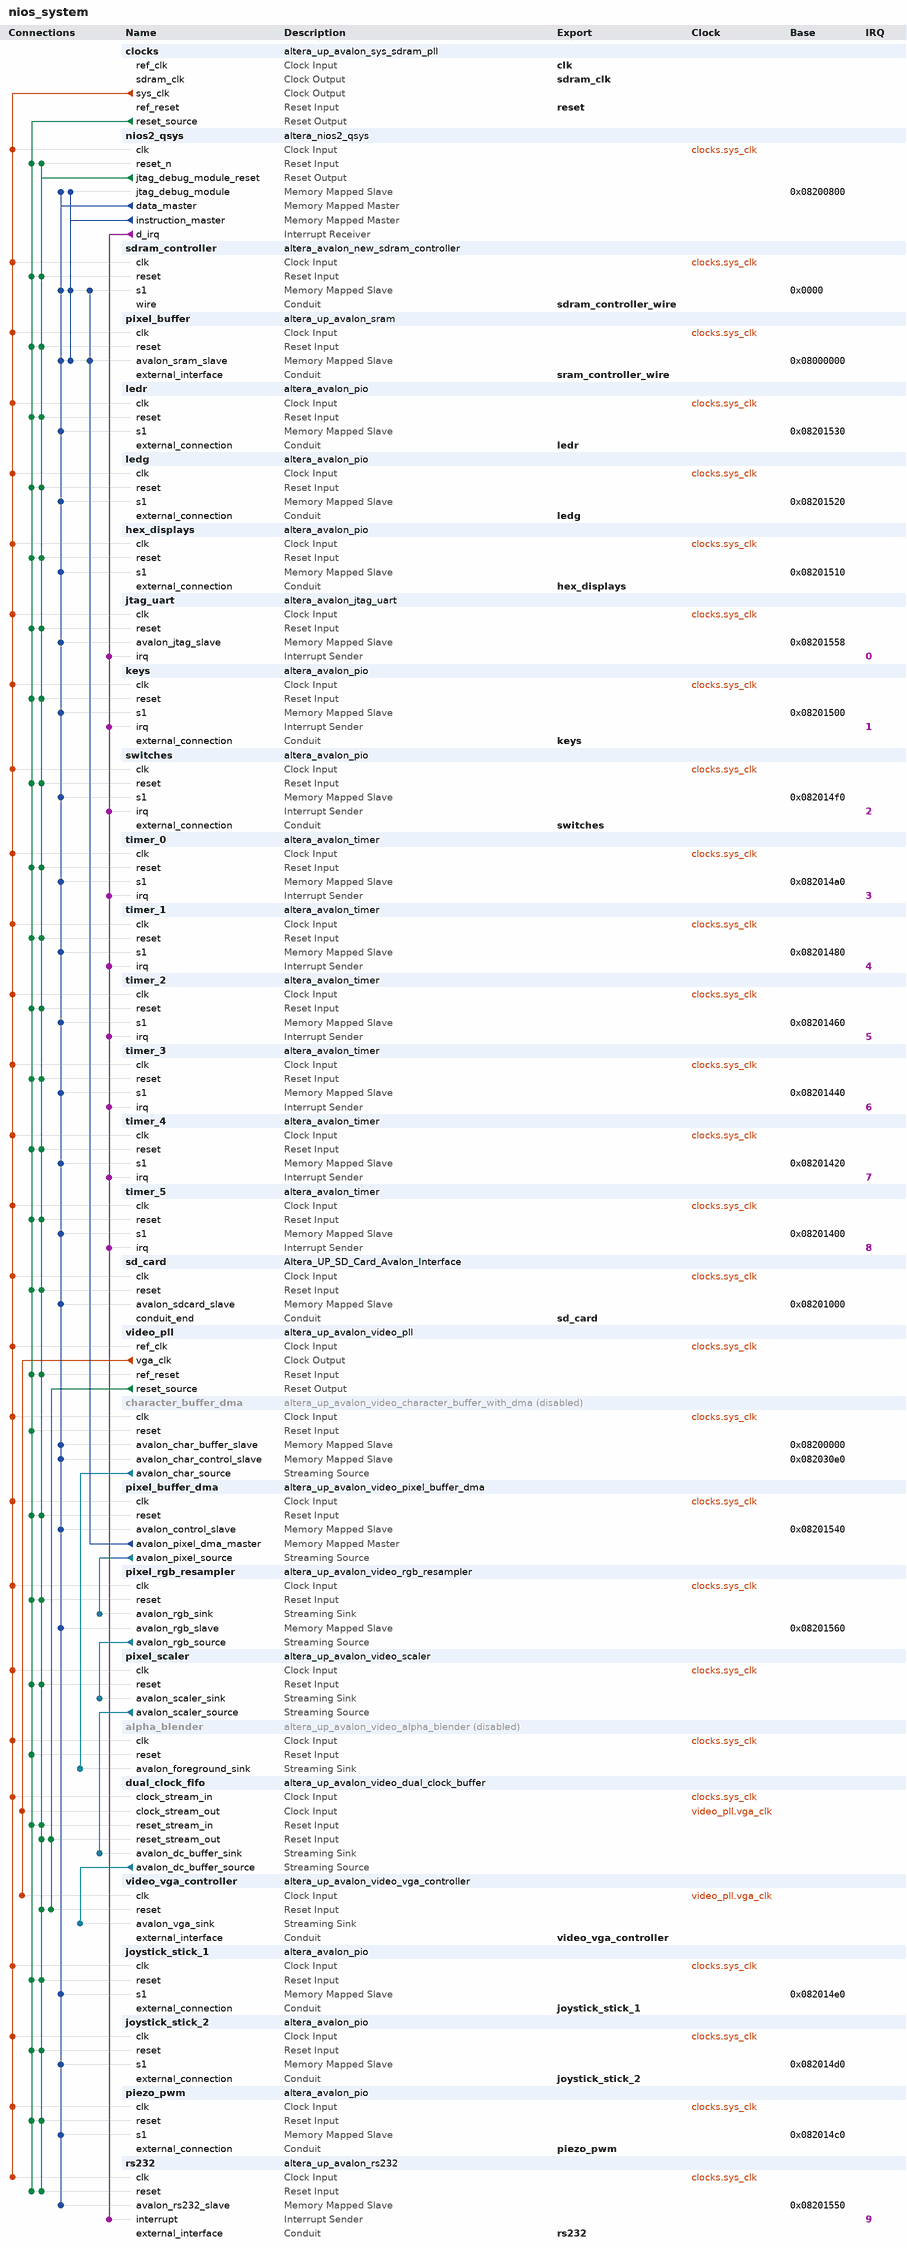
[diagram p0: system contents]
# Platform Designer (Qsys) system nios_system, Cyclone IV E EP4CE115F29C7
# Parameters at their usual value, and those the tool derives, are not listed.
package require -exact qsys 17.1
create_system nios_system
set_project_property DEVICE_FAMILY {Cyclone IV E}
set_project_property DEVICE EP4CE115F29C7

add_instance clocks altera_up_avalon_sys_sdram_pll 17.1
set_instance_parameter_value clocks CV_boards DE10-Standard
set_instance_parameter_value clocks gui_outclk 50.0
set_instance_parameter_value clocks gui_refclk 50.0

add_instance nios2_qsys altera_nios2_qsys 16.1
set_instance_parameter_value nios2_qsys breakSlave nios2_qsys.jtag_debug_module
set_instance_parameter_value nios2_qsys exceptionSlave sdram_controller.s1
set_instance_parameter_value nios2_qsys icache_size 4096
set_instance_parameter_value nios2_qsys impl Fast
set_instance_parameter_value nios2_qsys mmu_TLBMissExcSlave None
set_instance_parameter_value nios2_qsys muldiv_divider true
set_instance_parameter_value nios2_qsys resetSlave sdram_controller.s1
set_instance_parameter_value nios2_qsys resetrequest_enabled true

add_instance sdram_controller altera_avalon_new_sdram_controller 17.1
set_instance_parameter_value sdram_controller TAC 5.4
set_instance_parameter_value sdram_controller TRCD 15.0
set_instance_parameter_value sdram_controller TRP 15.0
set_instance_parameter_value sdram_controller casLatency 3
set_instance_parameter_value sdram_controller columnWidth 10
set_instance_parameter_value sdram_controller dataWidth 32
set_instance_parameter_value sdram_controller generateSimulationModel false
set_instance_parameter_value sdram_controller model single_Micron_MT48LC4M32B2_7_chip
set_instance_parameter_value sdram_controller numberOfBanks 4
set_instance_parameter_value sdram_controller numberOfChipSelects 1
set_instance_parameter_value sdram_controller powerUpDelay 100.0
set_instance_parameter_value sdram_controller refreshPeriod 7.8125
set_instance_parameter_value sdram_controller rowWidth 13

add_instance pixel_buffer altera_up_avalon_sram 17.1
set_instance_parameter_value pixel_buffer board DE2-115
set_instance_parameter_value pixel_buffer pixel_buffer true

add_instance ledr altera_avalon_pio 17.1
set_instance_parameter_value ledr direction Output
set_instance_parameter_value ledr width 18

add_instance ledg altera_avalon_pio 17.1
set_instance_parameter_value ledg direction Output
set_instance_parameter_value ledg width 9

add_instance hex_displays altera_avalon_pio 17.1
set_instance_parameter_value hex_displays direction Output
set_instance_parameter_value hex_displays width 32

add_instance jtag_uart altera_avalon_jtag_uart 17.1
set_instance_parameter_value jtag_uart simInteractiveOptions NO_INTERACTIVE_WINDOWS

add_instance keys altera_avalon_pio 17.1
set_instance_parameter_value keys captureEdge true
set_instance_parameter_value keys direction Input
set_instance_parameter_value keys edgeType FALLING
set_instance_parameter_value keys generateIRQ true
set_instance_parameter_value keys irqType EDGE
set_instance_parameter_value keys width 4

add_instance switches altera_avalon_pio 17.1
set_instance_parameter_value switches captureEdge true
set_instance_parameter_value switches direction Input
set_instance_parameter_value switches edgeType FALLING
set_instance_parameter_value switches generateIRQ true
set_instance_parameter_value switches irqType EDGE
set_instance_parameter_value switches width 18

add_instance timer_0 altera_avalon_timer 17.1
set_instance_parameter_value timer_0 period 1
set_instance_parameter_value timer_0 periodUnits MSEC

add_instance timer_1 altera_avalon_timer 17.1
set_instance_parameter_value timer_1 period 1
set_instance_parameter_value timer_1 periodUnits MSEC

add_instance timer_2 altera_avalon_timer 17.1
set_instance_parameter_value timer_2 period 1
set_instance_parameter_value timer_2 periodUnits MSEC

add_instance timer_3 altera_avalon_timer 17.1
set_instance_parameter_value timer_3 period 1
set_instance_parameter_value timer_3 periodUnits MSEC

add_instance timer_4 altera_avalon_timer 17.1
set_instance_parameter_value timer_4 period 1
set_instance_parameter_value timer_4 periodUnits MSEC

add_instance timer_5 altera_avalon_timer 17.1
set_instance_parameter_value timer_5 period 1
set_instance_parameter_value timer_5 periodUnits MSEC

add_instance sd_card Altera_UP_SD_Card_Avalon_Interface 17.1

add_instance video_pll altera_up_avalon_video_pll 17.1
set_instance_parameter_value video_pll camera {5MP Digital Camera (THDB_D5M)}
set_instance_parameter_value video_pll gui_refclk 50.0
set_instance_parameter_value video_pll lcd {7" LCD on VEEK-MT and MTL/MTL2 Modules}

add_instance character_buffer_dma altera_up_avalon_video_character_buffer_with_dma 17.1
set_instance_property character_buffer_dma ENABLED false
set_instance_parameter_value character_buffer_dma enable_transparency true

add_instance pixel_buffer_dma altera_up_avalon_video_pixel_buffer_dma 17.1
set_instance_parameter_value pixel_buffer_dma addr_mode X-Y
set_instance_parameter_value pixel_buffer_dma back_start_address 135266304
set_instance_parameter_value pixel_buffer_dma color_space {16-bit RGB}
set_instance_parameter_value pixel_buffer_dma image_height 240
set_instance_parameter_value pixel_buffer_dma image_width 320
set_instance_parameter_value pixel_buffer_dma start_address 134217728

add_instance pixel_rgb_resampler altera_up_avalon_video_rgb_resampler 17.1
set_instance_parameter_value pixel_rgb_resampler alpha 1023
set_instance_parameter_value pixel_rgb_resampler input_type {16-bit RGB}
set_instance_parameter_value pixel_rgb_resampler output_type {30-bit RGB}

add_instance pixel_scaler altera_up_avalon_video_scaler 17.1
set_instance_parameter_value pixel_scaler color_bits 10
set_instance_parameter_value pixel_scaler color_planes 3
set_instance_parameter_value pixel_scaler height_scaling 2
set_instance_parameter_value pixel_scaler width_in 320
set_instance_parameter_value pixel_scaler width_scaling 2

add_instance alpha_blender altera_up_avalon_video_alpha_blender 17.1
set_instance_property alpha_blender ENABLED false

add_instance dual_clock_fifo altera_up_avalon_video_dual_clock_buffer 17.1
set_instance_parameter_value dual_clock_fifo color_bits 10

add_instance video_vga_controller altera_up_avalon_video_vga_controller 17.1
set_instance_parameter_value video_vga_controller board DE2-115
set_instance_parameter_value video_vga_controller resolution {VGA 640x480}

add_instance joystick_stick_1 altera_avalon_pio 17.1
set_instance_parameter_value joystick_stick_1 direction Input
set_instance_parameter_value joystick_stick_1 width 5

add_instance joystick_stick_2 altera_avalon_pio 17.1
set_instance_parameter_value joystick_stick_2 direction Input
set_instance_parameter_value joystick_stick_2 width 5

add_instance piezo_pwm altera_avalon_pio 17.1
set_instance_parameter_value piezo_pwm direction Output
set_instance_parameter_value piezo_pwm width 1

add_instance rs232 altera_up_avalon_rs232 17.1
set_instance_parameter_value rs232 baud 9600
set_instance_parameter_value rs232 parity None

# connections
add_connection clocks.sys_clk alpha_blender.clk clock
add_connection clocks.sys_clk character_buffer_dma.clk clock
add_connection clocks.sys_clk dual_clock_fifo.clock_stream_in clock
add_connection clocks.sys_clk hex_displays.clk clock
add_connection clocks.sys_clk joystick_stick_1.clk clock
add_connection clocks.sys_clk joystick_stick_2.clk clock
add_connection clocks.sys_clk jtag_uart.clk clock
add_connection clocks.sys_clk keys.clk clock
add_connection clocks.sys_clk ledg.clk clock
add_connection clocks.sys_clk ledr.clk clock
add_connection clocks.sys_clk nios2_qsys.clk clock
add_connection clocks.sys_clk piezo_pwm.clk clock
add_connection clocks.sys_clk pixel_buffer.clk clock
add_connection clocks.sys_clk pixel_buffer_dma.clk clock
add_connection clocks.sys_clk pixel_rgb_resampler.clk clock
add_connection clocks.sys_clk pixel_scaler.clk clock
add_connection clocks.sys_clk rs232.clk clock
add_connection clocks.sys_clk sd_card.clk clock
add_connection clocks.sys_clk sdram_controller.clk clock
add_connection clocks.sys_clk switches.clk clock
add_connection clocks.sys_clk timer_0.clk clock
add_connection clocks.sys_clk timer_1.clk clock
add_connection clocks.sys_clk timer_2.clk clock
add_connection clocks.sys_clk timer_3.clk clock
add_connection clocks.sys_clk timer_4.clk clock
add_connection clocks.sys_clk timer_5.clk clock
add_connection clocks.sys_clk video_pll.ref_clk clock
add_connection video_pll.vga_clk dual_clock_fifo.clock_stream_out clock
add_connection video_pll.vga_clk video_vga_controller.clk clock
add_connection clocks.reset_source alpha_blender.reset reset
add_connection clocks.reset_source character_buffer_dma.reset reset
add_connection clocks.reset_source dual_clock_fifo.reset_stream_in reset
add_connection clocks.reset_source hex_displays.reset reset
add_connection clocks.reset_source joystick_stick_1.reset reset
add_connection clocks.reset_source joystick_stick_2.reset reset
add_connection clocks.reset_source jtag_uart.reset reset
add_connection clocks.reset_source keys.reset reset
add_connection clocks.reset_source ledg.reset reset
add_connection clocks.reset_source ledr.reset reset
add_connection clocks.reset_source nios2_qsys.reset_n reset
add_connection clocks.reset_source piezo_pwm.reset reset
add_connection clocks.reset_source pixel_buffer.reset reset
add_connection clocks.reset_source pixel_buffer_dma.reset reset
add_connection clocks.reset_source pixel_rgb_resampler.reset reset
add_connection clocks.reset_source pixel_scaler.reset reset
add_connection clocks.reset_source rs232.reset reset
add_connection clocks.reset_source sd_card.reset reset
add_connection clocks.reset_source sdram_controller.reset reset
add_connection clocks.reset_source switches.reset reset
add_connection clocks.reset_source timer_0.reset reset
add_connection clocks.reset_source timer_1.reset reset
add_connection clocks.reset_source timer_2.reset reset
add_connection clocks.reset_source timer_3.reset reset
add_connection clocks.reset_source timer_4.reset reset
add_connection clocks.reset_source timer_5.reset reset
add_connection clocks.reset_source video_pll.ref_reset reset
add_connection nios2_qsys.jtag_debug_module_reset dual_clock_fifo.reset_stream_in reset
add_connection nios2_qsys.jtag_debug_module_reset dual_clock_fifo.reset_stream_out reset
add_connection nios2_qsys.jtag_debug_module_reset hex_displays.reset reset
add_connection nios2_qsys.jtag_debug_module_reset joystick_stick_1.reset reset
add_connection nios2_qsys.jtag_debug_module_reset joystick_stick_2.reset reset
add_connection nios2_qsys.jtag_debug_module_reset jtag_uart.reset reset
add_connection nios2_qsys.jtag_debug_module_reset keys.reset reset
add_connection nios2_qsys.jtag_debug_module_reset ledg.reset reset
add_connection nios2_qsys.jtag_debug_module_reset ledr.reset reset
add_connection nios2_qsys.jtag_debug_module_reset nios2_qsys.reset_n reset
add_connection nios2_qsys.jtag_debug_module_reset piezo_pwm.reset reset
add_connection nios2_qsys.jtag_debug_module_reset pixel_buffer.reset reset
add_connection nios2_qsys.jtag_debug_module_reset pixel_buffer_dma.reset reset
add_connection nios2_qsys.jtag_debug_module_reset pixel_rgb_resampler.reset reset
add_connection nios2_qsys.jtag_debug_module_reset pixel_scaler.reset reset
add_connection nios2_qsys.jtag_debug_module_reset rs232.reset reset
add_connection nios2_qsys.jtag_debug_module_reset sd_card.reset reset
add_connection nios2_qsys.jtag_debug_module_reset sdram_controller.reset reset
add_connection nios2_qsys.jtag_debug_module_reset switches.reset reset
add_connection nios2_qsys.jtag_debug_module_reset timer_0.reset reset
add_connection nios2_qsys.jtag_debug_module_reset timer_1.reset reset
add_connection nios2_qsys.jtag_debug_module_reset timer_2.reset reset
add_connection nios2_qsys.jtag_debug_module_reset timer_3.reset reset
add_connection nios2_qsys.jtag_debug_module_reset timer_4.reset reset
add_connection nios2_qsys.jtag_debug_module_reset timer_5.reset reset
add_connection nios2_qsys.jtag_debug_module_reset video_pll.ref_reset reset
add_connection nios2_qsys.jtag_debug_module_reset video_vga_controller.reset reset
add_connection video_pll.reset_source dual_clock_fifo.reset_stream_out reset
add_connection video_pll.reset_source video_vga_controller.reset reset
add_connection nios2_qsys.data_master character_buffer_dma.avalon_char_buffer_slave avalon
set_connection_parameter_value nios2_qsys.data_master/character_buffer_dma.avalon_char_buffer_slave baseAddress 0x08200000
add_connection nios2_qsys.data_master character_buffer_dma.avalon_char_control_slave avalon
set_connection_parameter_value nios2_qsys.data_master/character_buffer_dma.avalon_char_control_slave baseAddress 0x082030e0
add_connection nios2_qsys.data_master hex_displays.s1 avalon
set_connection_parameter_value nios2_qsys.data_master/hex_displays.s1 baseAddress 0x08201510
add_connection nios2_qsys.data_master joystick_stick_1.s1 avalon
set_connection_parameter_value nios2_qsys.data_master/joystick_stick_1.s1 baseAddress 0x082014e0
add_connection nios2_qsys.data_master joystick_stick_2.s1 avalon
set_connection_parameter_value nios2_qsys.data_master/joystick_stick_2.s1 baseAddress 0x082014d0
add_connection nios2_qsys.data_master jtag_uart.avalon_jtag_slave avalon
set_connection_parameter_value nios2_qsys.data_master/jtag_uart.avalon_jtag_slave baseAddress 0x08201558
add_connection nios2_qsys.data_master keys.s1 avalon
set_connection_parameter_value nios2_qsys.data_master/keys.s1 baseAddress 0x08201500
add_connection nios2_qsys.data_master ledg.s1 avalon
set_connection_parameter_value nios2_qsys.data_master/ledg.s1 baseAddress 0x08201520
add_connection nios2_qsys.data_master ledr.s1 avalon
set_connection_parameter_value nios2_qsys.data_master/ledr.s1 baseAddress 0x08201530
add_connection nios2_qsys.data_master nios2_qsys.jtag_debug_module avalon
set_connection_parameter_value nios2_qsys.data_master/nios2_qsys.jtag_debug_module baseAddress 0x08200800
add_connection nios2_qsys.data_master piezo_pwm.s1 avalon
set_connection_parameter_value nios2_qsys.data_master/piezo_pwm.s1 baseAddress 0x082014c0
add_connection nios2_qsys.data_master pixel_buffer.avalon_sram_slave avalon
set_connection_parameter_value nios2_qsys.data_master/pixel_buffer.avalon_sram_slave baseAddress 0x08000000
add_connection nios2_qsys.data_master pixel_buffer_dma.avalon_control_slave avalon
set_connection_parameter_value nios2_qsys.data_master/pixel_buffer_dma.avalon_control_slave baseAddress 0x08201540
add_connection nios2_qsys.data_master pixel_rgb_resampler.avalon_rgb_slave avalon
set_connection_parameter_value nios2_qsys.data_master/pixel_rgb_resampler.avalon_rgb_slave baseAddress 0x08201560
add_connection nios2_qsys.data_master rs232.avalon_rs232_slave avalon
set_connection_parameter_value nios2_qsys.data_master/rs232.avalon_rs232_slave baseAddress 0x08201550
add_connection nios2_qsys.data_master sd_card.avalon_sdcard_slave avalon
set_connection_parameter_value nios2_qsys.data_master/sd_card.avalon_sdcard_slave baseAddress 0x08201000
add_connection nios2_qsys.data_master sdram_controller.s1 avalon
set_connection_parameter_value nios2_qsys.data_master/sdram_controller.s1 baseAddress 0x0000
add_connection nios2_qsys.data_master switches.s1 avalon
set_connection_parameter_value nios2_qsys.data_master/switches.s1 baseAddress 0x082014f0
add_connection nios2_qsys.data_master timer_0.s1 avalon
set_connection_parameter_value nios2_qsys.data_master/timer_0.s1 baseAddress 0x082014a0
add_connection nios2_qsys.data_master timer_1.s1 avalon
set_connection_parameter_value nios2_qsys.data_master/timer_1.s1 baseAddress 0x08201480
add_connection nios2_qsys.data_master timer_2.s1 avalon
set_connection_parameter_value nios2_qsys.data_master/timer_2.s1 baseAddress 0x08201460
add_connection nios2_qsys.data_master timer_3.s1 avalon
set_connection_parameter_value nios2_qsys.data_master/timer_3.s1 baseAddress 0x08201440
add_connection nios2_qsys.data_master timer_4.s1 avalon
set_connection_parameter_value nios2_qsys.data_master/timer_4.s1 baseAddress 0x08201420
add_connection nios2_qsys.data_master timer_5.s1 avalon
set_connection_parameter_value nios2_qsys.data_master/timer_5.s1 baseAddress 0x08201400
add_connection nios2_qsys.instruction_master nios2_qsys.jtag_debug_module avalon
set_connection_parameter_value nios2_qsys.instruction_master/nios2_qsys.jtag_debug_module baseAddress 0x08200800
add_connection nios2_qsys.instruction_master pixel_buffer.avalon_sram_slave avalon
set_connection_parameter_value nios2_qsys.instruction_master/pixel_buffer.avalon_sram_slave baseAddress 0x08000000
add_connection nios2_qsys.instruction_master sdram_controller.s1 avalon
set_connection_parameter_value nios2_qsys.instruction_master/sdram_controller.s1 baseAddress 0x0000
add_connection pixel_buffer_dma.avalon_pixel_dma_master pixel_buffer.avalon_sram_slave avalon
set_connection_parameter_value pixel_buffer_dma.avalon_pixel_dma_master/pixel_buffer.avalon_sram_slave baseAddress 0x08000000
add_connection pixel_buffer_dma.avalon_pixel_dma_master sdram_controller.s1 avalon
set_connection_parameter_value pixel_buffer_dma.avalon_pixel_dma_master/sdram_controller.s1 baseAddress 0x0000
add_connection character_buffer_dma.avalon_char_source alpha_blender.avalon_foreground_sink avalon_streaming
add_connection dual_clock_fifo.avalon_dc_buffer_source video_vga_controller.avalon_vga_sink avalon_streaming
add_connection pixel_buffer_dma.avalon_pixel_source pixel_rgb_resampler.avalon_rgb_sink avalon_streaming
add_connection pixel_rgb_resampler.avalon_rgb_source pixel_scaler.avalon_scaler_sink avalon_streaming
add_connection pixel_scaler.avalon_scaler_source dual_clock_fifo.avalon_dc_buffer_sink avalon_streaming
add_connection nios2_qsys.d_irq jtag_uart.irq interrupt
set_connection_parameter_value nios2_qsys.d_irq/jtag_uart.irq irqNumber 0
add_connection nios2_qsys.d_irq keys.irq interrupt
set_connection_parameter_value nios2_qsys.d_irq/keys.irq irqNumber 1
add_connection nios2_qsys.d_irq rs232.interrupt interrupt
set_connection_parameter_value nios2_qsys.d_irq/rs232.interrupt irqNumber 9
add_connection nios2_qsys.d_irq switches.irq interrupt
set_connection_parameter_value nios2_qsys.d_irq/switches.irq irqNumber 2
add_connection nios2_qsys.d_irq timer_0.irq interrupt
set_connection_parameter_value nios2_qsys.d_irq/timer_0.irq irqNumber 3
add_connection nios2_qsys.d_irq timer_1.irq interrupt
set_connection_parameter_value nios2_qsys.d_irq/timer_1.irq irqNumber 4
add_connection nios2_qsys.d_irq timer_2.irq interrupt
set_connection_parameter_value nios2_qsys.d_irq/timer_2.irq irqNumber 5
add_connection nios2_qsys.d_irq timer_3.irq interrupt
set_connection_parameter_value nios2_qsys.d_irq/timer_3.irq irqNumber 6
add_connection nios2_qsys.d_irq timer_4.irq interrupt
set_connection_parameter_value nios2_qsys.d_irq/timer_4.irq irqNumber 7
add_connection nios2_qsys.d_irq timer_5.irq interrupt
set_connection_parameter_value nios2_qsys.d_irq/timer_5.irq irqNumber 8

# exported interfaces
add_interface clk clock sink
set_interface_property clk EXPORT_OF clocks.ref_clk
add_interface hex_displays conduit end
set_interface_property hex_displays EXPORT_OF hex_displays.external_connection
add_interface joystick_stick_1 conduit end
set_interface_property joystick_stick_1 EXPORT_OF joystick_stick_1.external_connection
add_interface joystick_stick_2 conduit end
set_interface_property joystick_stick_2 EXPORT_OF joystick_stick_2.external_connection
add_interface keys conduit end
set_interface_property keys EXPORT_OF keys.external_connection
add_interface ledg conduit end
set_interface_property ledg EXPORT_OF ledg.external_connection
add_interface ledr conduit end
set_interface_property ledr EXPORT_OF ledr.external_connection
add_interface piezo_pwm conduit end
set_interface_property piezo_pwm EXPORT_OF piezo_pwm.external_connection
add_interface reset reset sink
set_interface_property reset EXPORT_OF clocks.ref_reset
add_interface rs232 conduit end
set_interface_property rs232 EXPORT_OF rs232.external_interface
add_interface sd_card conduit end
set_interface_property sd_card EXPORT_OF sd_card.conduit_end
add_interface sdram_clk clock source
set_interface_property sdram_clk EXPORT_OF clocks.sdram_clk
add_interface sdram_controller_wire conduit end
set_interface_property sdram_controller_wire EXPORT_OF sdram_controller.wire
add_interface sram_controller_wire conduit end
set_interface_property sram_controller_wire EXPORT_OF pixel_buffer.external_interface
add_interface switches conduit end
set_interface_property switches EXPORT_OF switches.external_connection
add_interface video_vga_controller conduit end
set_interface_property video_vga_controller EXPORT_OF video_vga_controller.external_interface

set_interconnect_requirement {$system} qsys_mm.clockCrossingAdapter HANDSHAKE
set_interconnect_requirement {$system} qsys_mm.enableEccProtection FALSE
set_interconnect_requirement {$system} qsys_mm.insertDefaultSlave FALSE
set_interconnect_requirement {$system} qsys_mm.maxAdditionalLatency 1

save_system nios_system.qsys
